# EAGLE design RPI-Lora-Gateway-Shield (EAGLE 7.7.0)
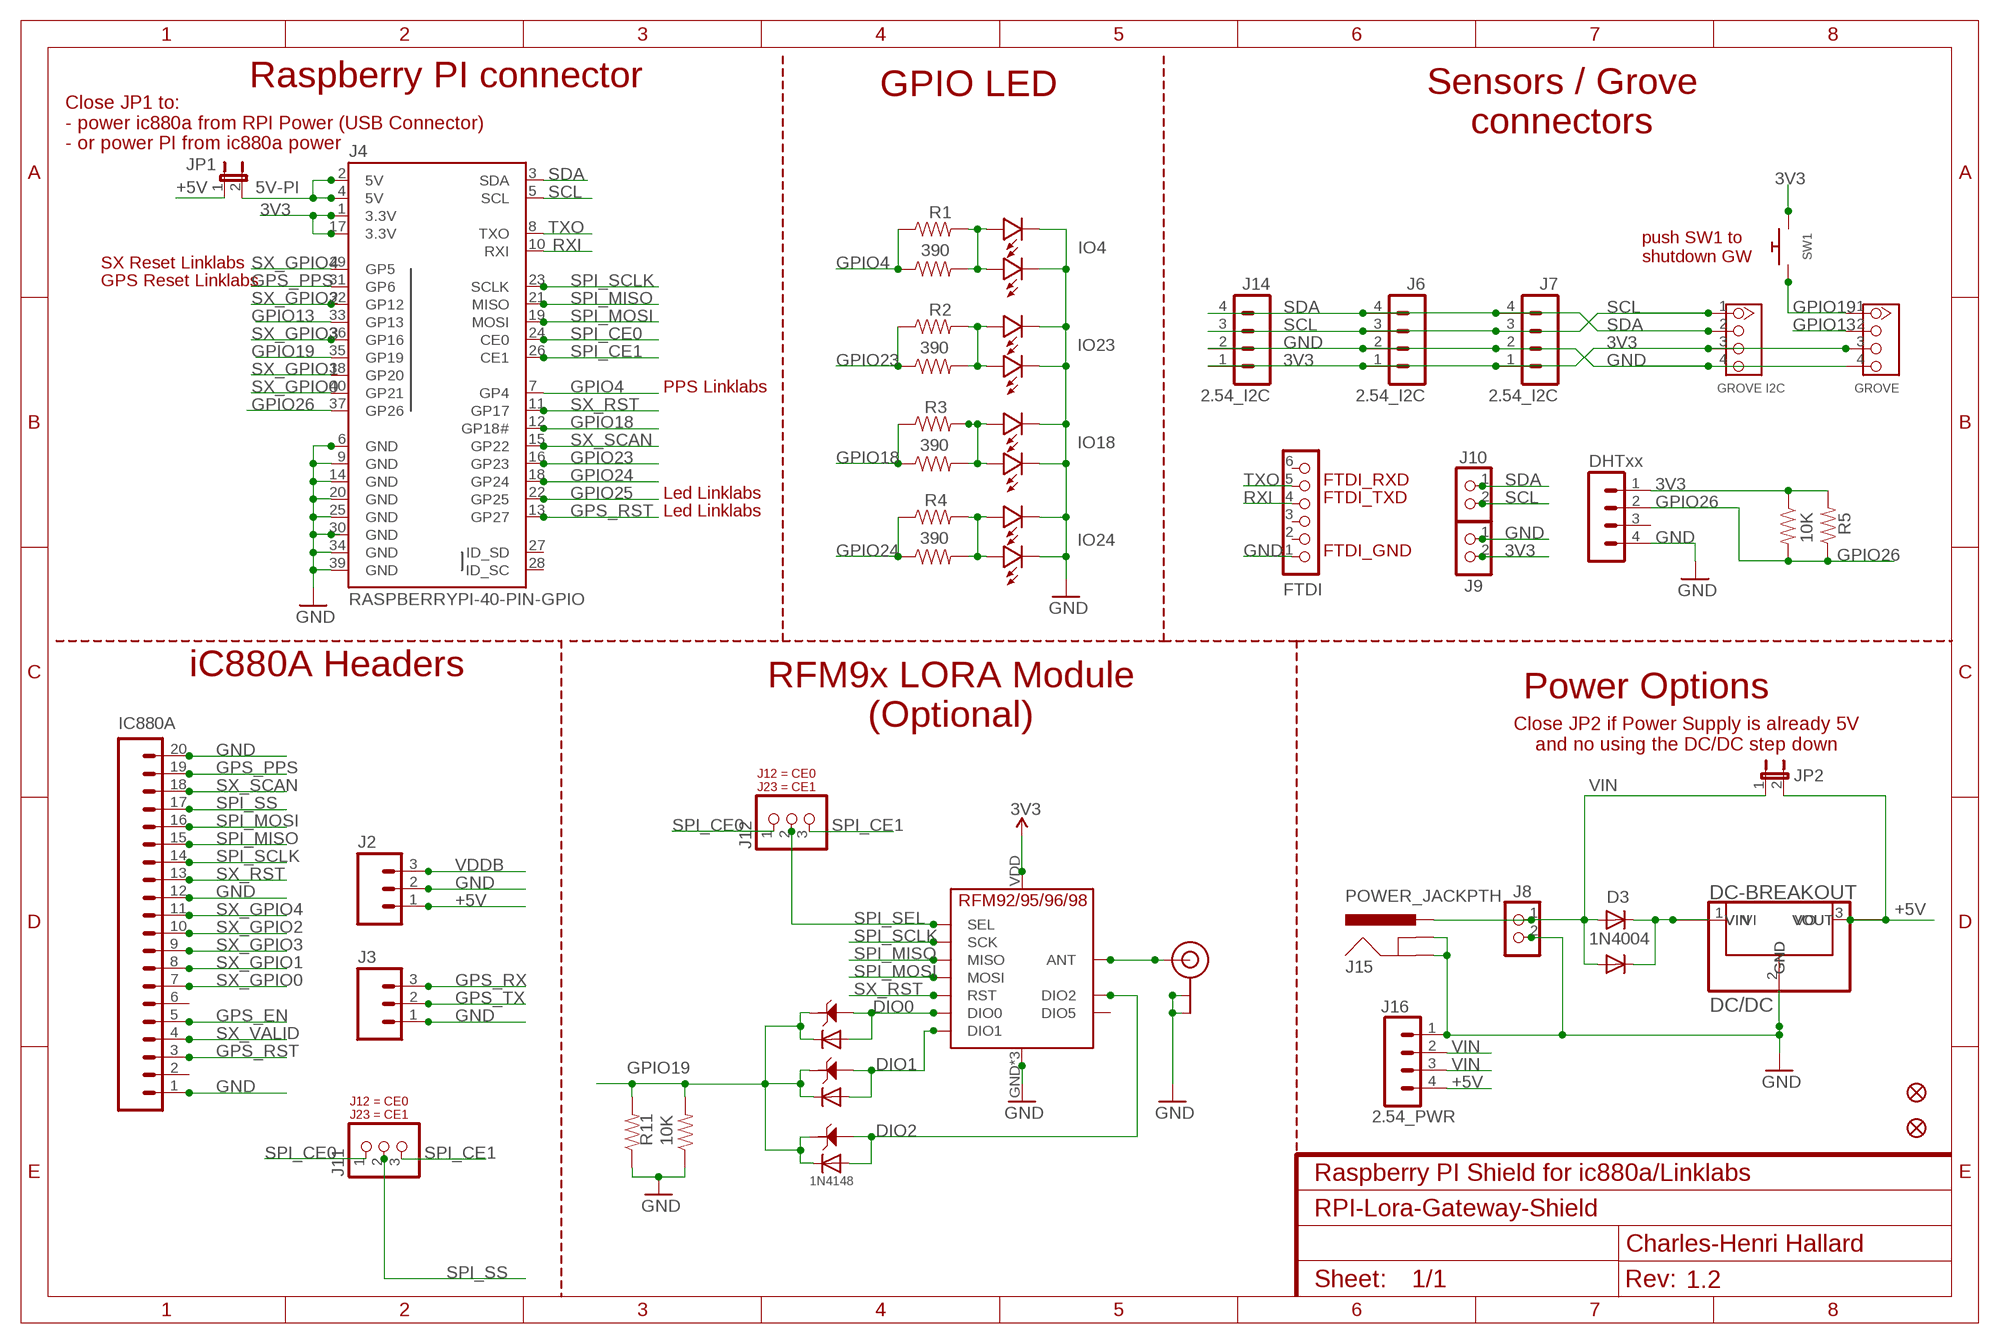
[diagram p0: schematic, sheet 1]
NAME (FRAME-A4L): CNAME: Raspberry PI Shield for ic880a/Linklabs; CREVISION: 1.2; DESIGNER: Charles-Henri Hallard

## Parts
D0  1N4148  D-ESD-2P-CESD5V0D1  [SOD123-2.7X1.6]
D1  1N4148  D-ESD-2P-CESD5V0D1  [SOD123-2.7X1.6]
D2  1N4148  D-ESD-2P-CESD5V0D1  [SOD123-2.7X1.6]
D3  1N4004  [DO41-10]
D4  1N4007  DIODE-DO-214AC  [DO-214AC]
D5  1N4148  DIODEDO-1N4148  [DO-1N4148]
D6  DIODEDO-1N4148  [DO-1N4148]
D7  DIODEDO-1N4148  [DO-1N4148]
DC/DC  DC-BREAKOUT  DC-BREAKOUTSTD  [DC-BREAKOUT]
FID2  FIDUCIAL""  [FIDUCIAL_1MM]
FID3  FIDUCIAL""  [FIDUCIAL_1MM]
FTDI  CON_HEADER_1X06-PTH  [M1X6]
IC880A  M20LOCK  [1X20_LOCK]
J1  GROVE  GROVE-CONNECTOR-DIP(4P-2.0)  [HW4-2.0]
J2  M03LOCK  [1X03_LOCK]
J3  M03LOCK  [1X03_LOCK]
J4  RASPBERRYPI-40-PIN-GPIO  [2X20-SHROUDED]
J5  DHTxx  CON_HEADER_1X04'NO_LOCK'  [1X04_NO_LOCK]
J6  2.54_I2C  CON_HEADER_1X04'NO_LOCK'  [1X04_NO_LOCK]
J7  2.54_I2C  CON_HEADER_1X04'NO_LOCK'  [1X04_NO_LOCK]
J8  CON_TERMINAL_BLOCK_02-5MM  [TERMINAL_BLOCK_2P_5]
J9  CON_TERMINAL_BLOCK_02-5MM  [TERMINAL_BLOCK_2P_5]
J10  CON_TERMINAL_BLOCK_02-5MM  [TERMINAL_BLOCK_2P_5]
J11  JUMPER_1X30805  [JP3_0805]
J12  JUMPER_1X30805  [JP3_0805]
J13  GROVE I2C  GROVE-CONNECTOR-DIP(4P-2.0)  [HW4-2.0]
J14  2.54_I2C  CON_HEADER_1X04'NO_LOCK'  [1X04_NO_LOCK]
J15  POWER_JACKPTH  [POWER_JACK_PTH]
J16  2.54_PWR  CON_HEADER_1X04'NO_LOCK'  [1X04_NO_LOCK]
JP1  JUMPER2  [JUMPER2]
JP2  JUMPER2  [JUMPER2]
LED1  LED0805  [0805-LED]
LED2  LED0805  [0805-LED]
LED3  LED0805  [0805-LED]
LED4  LED0805  [0805-LED]
R1  390  RESISTORPTH-1/4W  [AXIAL-0.4]
R2  390  RESISTORPTH-1/4W  [AXIAL-0.4]
R3  390  RESISTORPTH-1/4W  [AXIAL-0.4]
R4  390  RESISTORPTH-1/4W  [AXIAL-0.4]
R5  10K  RESISTORPTH-1/4W  [AXIAL-0.4]
R6  RESISTOR0805-RES  [0805-RES]
R7  RESISTOR0805-RES  [0805-RES]
R8  RESISTOR0805-RES  [0805-RES]
R9  RESISTOR0805-RES  [0805-RES]
R10  RESISTOR0805-RES  [0805-RES]
R11  10K  RESISTORPTH-1/4W  [AXIAL-0.4]
R12  RESISTOR0805-RES  [0805-RES]
SW1  SWITCH_PUSHBUTTONEVQ-PE  [TACT_PANA-EVQ]
U$2  RFM95  [RFM95]
U$3  ANTENNA-UFL  [UFL_PAD]
U$4  IO4  LED3MM  [LED3MM]
U$5  IO23  LED3MM  [LED3MM]
U$6  IO18  LED3MM  [LED3MM]
U$7  IO24  LED3MM  [LED3MM]
U$8  DC-BREAKOUTFIXED  [DC-DC-FIXED]
U$11  OKI-78SR  DCDC_OKI-78SRHORZ  [OKI-78SRH]

## Nets
3V3: J1.3 J4.1(3.3V) J4.17(3.3V) J5.1 J6.1 J7.1 J9.2 J13.3 J14.1 R5.P$1 R10.2 SW1.P$2 U$2.VDD(VCC)
5V-PI: J4.2(5V) J4.4(5V) JP1.2
+5V: DC/DC.VOUT-1(VOUT) DC/DC.VOUT-2(VOUT) J2.1 J16.4 JP1.1 JP2.2 U$8.VOUT-1(VOUT) U$8.VOUT-2(VOUT) U$11.3(VO)
DIO0: D0.1 D6.A U$2.DIO0
DIO1: D1.1 D7.A U$2.DIO1
DIO2: D2.1 D5.A U$2.DIO2
GND: DC/DC.GND-1(GND) DC/DC.GND-2(GND) DC/DC.GND-3(GND) DC/DC.GND-4(GND) FTDI.1 IC880A.1 IC880A.12 IC880A.20 J1.4 J2.2 J3.1 J4.6(GND) J4.9(GND) J4.14(GND) J4.20(GND) J4.25(GND) J4.30(GND) J4.34(GND) J4.39(GND) J5.4 J6.2 J7.2 J8.2 J9.1 J13.4 J14.2 J15.GND J15.GNDBREAK J16.1 LED1.MINUS LED2.MINUS LED3.MINUS LED4.MINUS R11.P$1 R12.1 U$2.GND U$2.GND1(GND) U$2.GND2(GND) U$3.GND1(GND) U$3.GND2(GND) U$4.MINUS U$5.MINUS U$6.MINUS U$7.MINUS U$8.GND-1(GND) U$8.GND-2(GND) U$8.GND-3(GND) U$8.GND-4(GND) U$11.2(GND)
GPIO4: J4.7(GP4) R1.P$1 R6.1
GPIO13: J1.2 J4.33(GP13)
GPIO18: J4.12(GP18#) R3.P$1 R8.1
GPIO19: D0.2 D1.2 D2.2 D5.C D6.C D7.C J1.1 J4.35(GP19) R11.P$2 R12.2 SW1.P$1
GPIO23: J4.16(GP23) R2.P$1 R7.1
GPIO24: J4.18(GP24) R4.P$1 R9.1
GPIO25: J4.22(GP25)
GPIO26: J4.37(GP26) J5.2 R5.P$2 R10.1
GPS_EN: IC880A.5
GPS_PPS: IC880A.19 J4.31(GP6)
GPS_RST: IC880A.3 J4.13(GP27)
GPS_RX: J3.3
GPS_TX: J3.2
N$14: D3.C D4.1(C) DC/DC.VIN-1(VIN) DC/DC.VIN-2(VIN) U$8.VIN-1(VIN) U$8.VIN-2(VIN) U$11.1(VI)
N$16: LED4.PLUS R4.P$2 R9.2 U$7.PLUS
N$18: LED1.PLUS R1.P$2 R6.2 U$4.PLUS
N$26: LED2.PLUS R2.P$2 R7.2 U$5.PLUS
N$27: LED3.PLUS R3.P$2 R8.2 U$6.PLUS
N$29: U$2.ANT U$3.ANT1(SIGNAL) U$3.ANT2(SIGNAL)
RXI: FTDI.4 J4.10(RXI)
SCL: J4.5(SCL) J6.3 J7.3 J10.2 J13.1 J14.3
SDA: J4.3(SDA) J6.4 J7.4 J10.1 J13.2 J14.4
SPI_CE0: J4.24(CE0) J11.1 J12.1
SPI_CE1: J4.26(CE1) J11.3 J12.3
SPI_MISO: IC880A.15 J4.21(MISO) U$2.MISO
SPI_MOSI: IC880A.16 J4.19(MOSI) U$2.MOSI
SPI_SCLK: IC880A.14 J4.23(SCLK) U$2.SCK
SPI_SEL: J12.2 U$2.NSS(SEL)
SPI_SS: IC880A.17 J11.2
SX_GPIO0: IC880A.7 J4.40(GP21)
SX_GPIO1: IC880A.8 J4.38(GP20)
SX_GPIO2: IC880A.10 J4.32(GP12)
SX_GPIO3: IC880A.9 J4.36(GP16)
SX_GPIO4: IC880A.11 J4.29(GP5)
SX_RST: IC880A.13 J4.11(GP17) U$2.RST
SX_SCAN: IC880A.18 J4.15(GP22)
SX_VALID: IC880A.4
TXO: FTDI.5 J4.8(TXO)
VDDB: J2.3
VIN: D3.A D4.2(A) J8.1 J15.PWR J16.2 J16.3 JP2.1
Unconnected: FTDI.2 FTDI.3 FTDI.6 IC880A.2 IC880A.6 J4.27(ID_SD) J4.28(ID_SC) J5.3 U$2.DIO5

## Notes on the sheet
- Raspberry PI connector | GPIO LED
- Sensors / Grove
  connectors
- Close JP1 to:
  - power ic880a from RPI Power (USB Connector)
  - or power PI from ic880a power
- push SW1 to
  shutdown GW
- SX Reset Linklabs
- GPS Reset Linklabs
- PPS Linklabs
- FTDI_RXD
- Led Linklabs | FTDI_TXD
- Led Linklabs
- FTDI_GND
- iC880A Headers | Power Options
- RFM9x LORA Module
  (Optional)
- Close JP2 if Power Supply is already 5V
  and no using the DC/DC step down

## Library data of the parts
D0 D1 D2 = Seeed-Discrete:D-ESD-2P: Diodes for Protectiong against ESD
D3 = adafruit:1N4004: DIODE General purpose 1N400x type rectifier (With bigger pads) http://www.ladyada.net/library/pcb/eaglelibrary.html
D4 = dp_devices:DIODE: Various Diode Packages
D5-D7 = adafruit:DIODE: Diode SMADIODE - SMA Surface Mount Package 20V 1A Schottky Diode Digikey: 641-1014-6-ND DO-1N4148 - Through Hole Small Current Diode SOD-123 20V 1 A (.5mV Vf) Schottky Diode - Digikey: MBRX120TPMSCT-ND SOD-323 10V 570mA (.38mV Vf, 3ns) Schottky Diode - Digikey: ZLLS410CT-ND SOD-523 30V 30mA Schottky Diode (RB751S-40TE61) - Digikey: RB751S-40TE61CT-ND SOT23-R/W - SOT23 Package (R = Solder Paste/Reflow Ovens, W = Hand-Soldering) BAT54Film 40V 300mA - Digikey: 497-7162-1-ND
DC/DC U$8 = _c2h:DC-BREAKOUT
FID2 FID3 = microbuilder:FIDUCIAL: Fiducial Alignment Points Various fiducial points for machine vision alignment.; BOM: EXCLUDE
FTDI = _c2h:CON_HEADER_1X06
IC880A = SparkFun-Connectors:M20: 1x20 .1" header This is just like the LOCK variant in that the holes are staggared by 5 mil, but except for the last two holes. They are not altered from the "standard" footprint layout. This is used for a special purpose on the layout of our Graphic LCD Backpack. Make sure you want to use this device before selecting it for you project!
J1 J13 = Connector -2016:GROVE-CONNECTOR-DIP(4P-2.0): 320110033; VALUE: 4P-2.0
J2 J3 = SparkFun-Connectors:M03: Header 3 Standard 3-pin 0.1" header. Use with straight break away headers (SKU : PRT-00116), right angle break away headers (PRT-00553), swiss pins (PRT-00743), machine pins (PRT-00117), and female headers (PRT-00115). Molex polarized connector foot print use with SKU : PRT-08232 with associated crimp pins and housings.
J4 = _c2h:RASPBERRYPI-40-PIN-GPIO: Second Generation Raspberry Pi GPIO Header 2x20 pin connector, as found on B, B+, A+ models.
J5-J7 J14 J16 = _c2h:CON_HEADER_1X04
J8-J10 = dp_devices:CON_TERMINAL_BLOCK_02: 2 poles wire to board terminal block
J11 J12 = dp_devices:JUMPER_1X3; J12: CE0; J23: CE1
J15 = SparkFun-Connectors:POWER_JACK: Power Jack This is the standard 5.5mm barrel jack for power. The PTH is the most common, proven, reliable, footprint. The Slot footprint only works if the mill layer is transmitted to the PCB fab house so be warned. Spark Fun Electronics SKU : PRT-00119 SMT: CONN-08106 Mating wall wart : TOL-00298 (and others)
JP1 JP2 = microbuilder:JUMPER2: JUMPER - 2 Pins
LED1-LED4 U$4-U$7 = _c2h:LED
R1-R12 = _c2h:RESISTOR: Resistor Basic schematic elements and footprints for 0603, 1206, and PTH resistors.
SW1 = adafruit:SWITCH_PUSHBUTTON: Buttons SOFTTOUCHSMD_SJ - Soft touch temporary push button (Super Junk Akihabara) Compatible with SKPMANE010 [Mouser: 688-SKPMAN] C&K_KSS = Digikey: KSS221GLFS
U$2 = _c2h:RFM95
U$3 = _c2h:ANTENNA-UFL
U$11 = _c2h:DCDC_OKI-78SR: 4.95W DC/DC Converter Manufacturer: Murata Part Number: OKI-78SR-5/1.5-W36H-C OKI-78SR-3.3/1.5-W36H-C

## Board
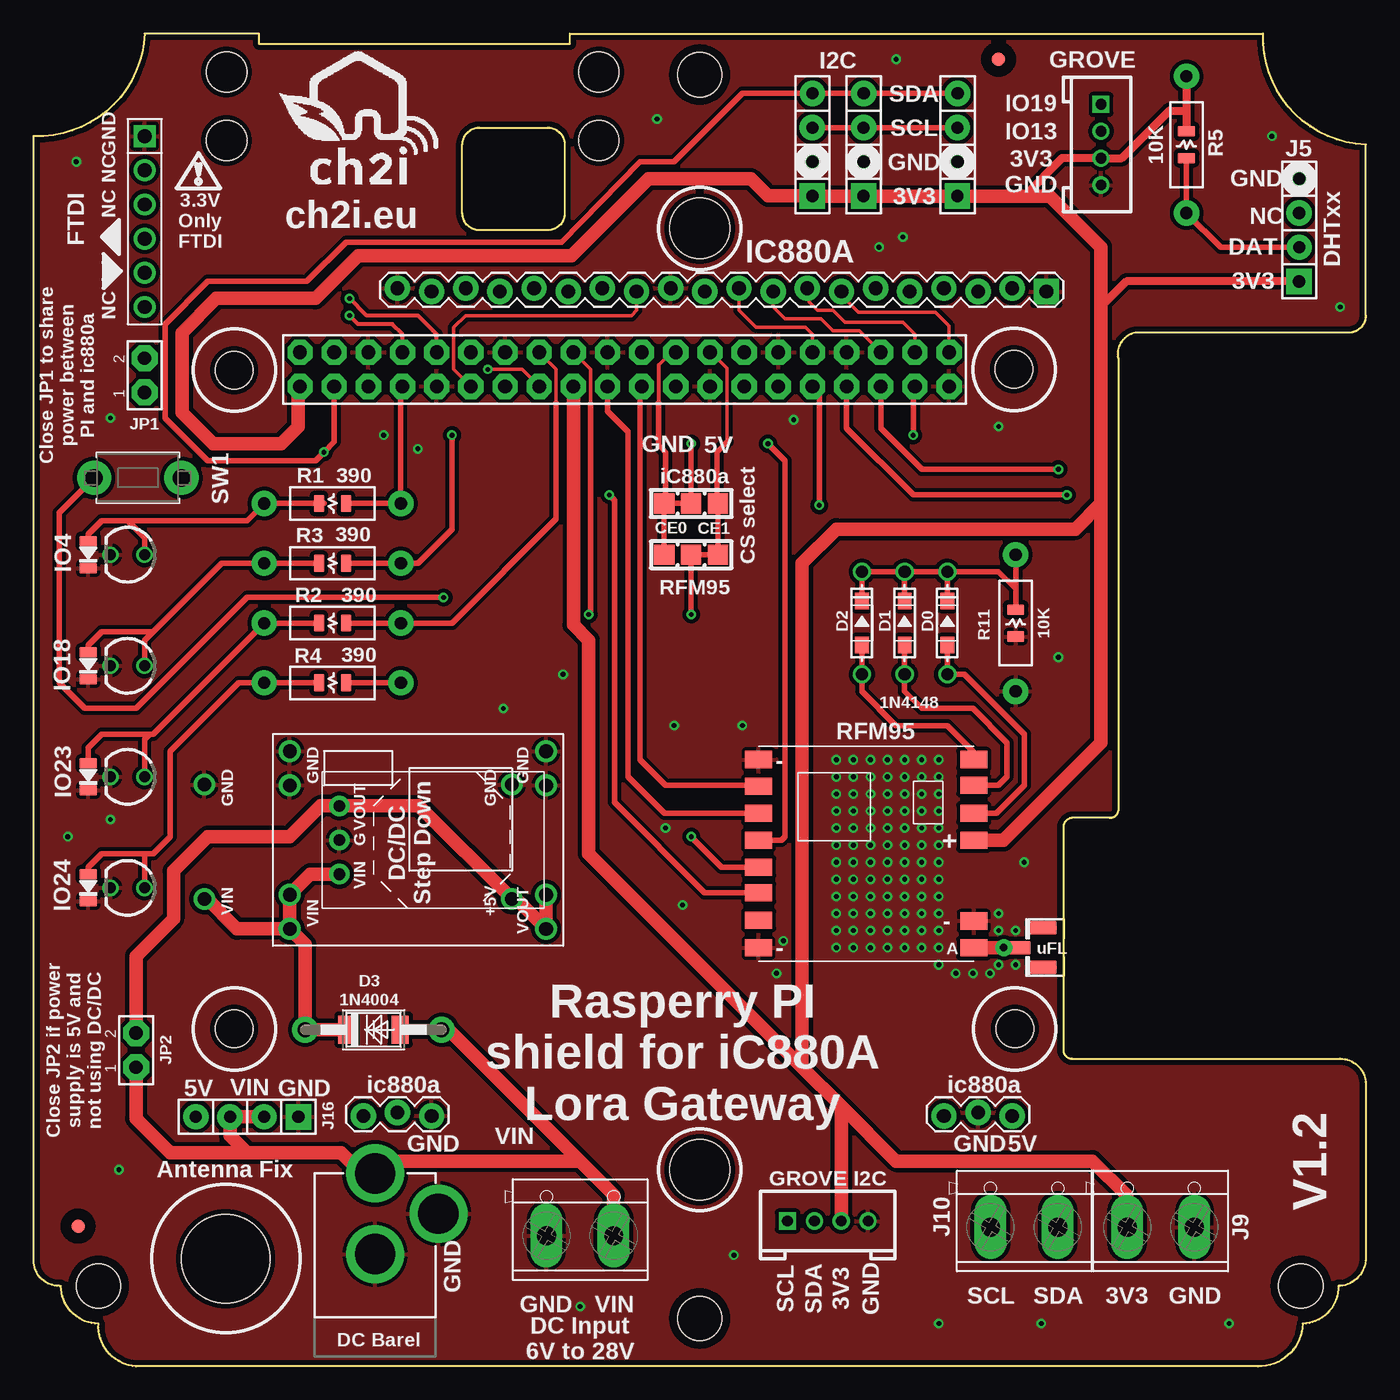
[diagram p1: board, top side]
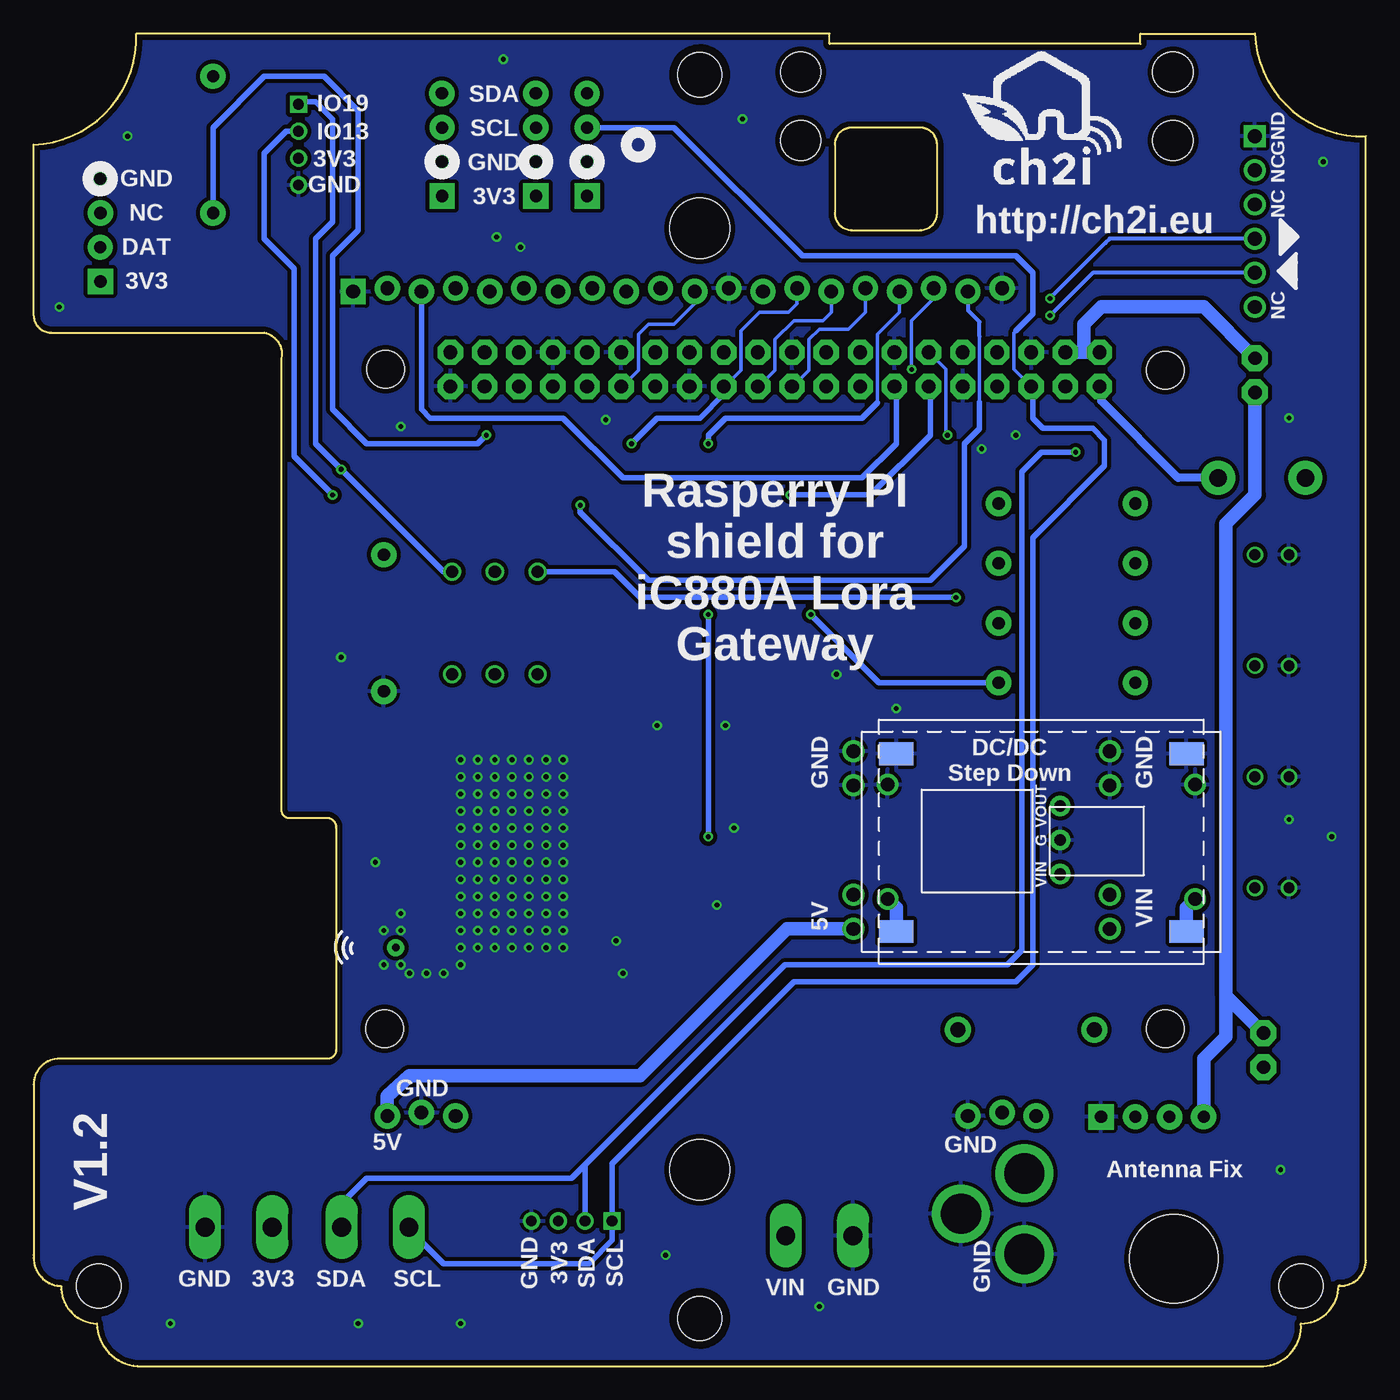
[diagram p2: board, bottom side, seen from below]

Size 99.07 x 99.06 mm. Coordinates in mm from the lower left corner, seen from the top.
Outline: 0,7.87 0,91.44 arc90 8.26,99.06 16.76,99.06 16.76,98.3 39.88,98.3 39.88,99.06 91.44,99.06 arc90 99.06,90.81 99.06,78.11 arc-90 97.79,76.83 81.92,76.83 arc90 80.64,74.93 80.64,41.27 arc-90 80.01,40.77 77.22,40.77 arc90 76.58,40.01 76.58,23.5 arc90 77.22,22.86 97.16,22.86 arc-90 99.06,20.95 99.06,8.26 arc-90 97.16,5.97 97.03,5.97 arc-90 94.36,3.17 arc-90 91.06,0 7.62,0 arc-90 4.83,3.17 arc-90 2.03,5.97 1.91,5.97 arc-90 0,7.87
Outline: 31.88,85.72 31.88,90.81 arc-90 33.15,92.08 38.23,92.08 arc-90 39.5,90.81 39.5,85.72 arc-90 38.23,84.45 33.15,84.45 arc-90 31.88,85.72
Copper layers (1*16): Top 0.0356mm / dielectric 1.5011mm / Bottom 0.0356mm
Design rules "PCBs_io": minimum track width 6mil, minimum drill 13mil, track to track 6mil, track to pad 6mil, pad to pad 6mil, via to via 6mil, smd to smd 6mil, copper to edge 15mil, drill to drill 6mil, minimum pad ring 7mil, minimum via ring 7mil, stop-mask expansion 3mil, vias tented up to drill 40mil, thermal gap 10mil
Holes 2.79 mm at 14.92,74.04 72.9,74.1 72.96,25.08 14.92,25.08
Holes 6.6 mm at 14.29,8
Holes 4.5 mm at 49.53,14.61 49.53,84.58
Holes 3 mm at 42.04,96.2 14.35,96.2 42.04,91.12 14.35,91.12

### Footprints (pad centres in the part's own frame; a part is rotated, then mirrored left to right if it is on the bottom)
SOD123-2.7X1.6 = smd 1.2 x 1.02: 1 -1.635,0; 2 1.635,0
DO41-10 = drill 1.118 pad 1.93: A 5.08,0; C -5.08,0
DO-214AC = smd 1.27 x 2.1: 1 -1.98,0; 2 1.98,0
DO-1N4148 = drill 0.9: A -3.81,0; C 3.81,0
DC-BREAKOUT = drill 1.02 pad 1.632: GND-1 -10.16,6.35; GND-2 -10.16,3.81; GND-3 8.89,6.35; GND-4 8.89,3.81; VIN-1 -10.16,-4.318; VIN-2 -10.16,-6.858; VOUT-1 8.89,-4.318; VOUT-2 8.89,-6.858
FIDUCIAL_1MM = smd 1 x 1: 1 0,0
M1X6 = drill 1.02 pad 1.632 square: 1 0,0 | drill 1.02 pad 1.632: 2 2.54,0; 3 5.08,0; 4 7.62,0; 5 10.16,0; 6 12.7,0
STAND-OFF = hole 3.302: 0,0
1X20_LOCK = drill 1.016 pad 1.88 square: 1 0,0.127 | drill 1.016 pad 1.88: 2 2.54,-0.127; 3 5.08,0.127; 4 7.62,-0.127; 5 10.16,0.127; 6 12.7,-0.127; 7 15.24,0.127; 8 17.78,-0.127; 9 20.32,0.127; 10 22.86,-0.127; 11 25.4,0.127; 12 27.94,-0.127; 13 30.48,0.127; 14 33.02,-0.127; 15 35.56,0.127; 16 38.1,-0.127; 17 40.64,0.127; 18 43.18,-0.127; 19 45.72,0.127; 20 48.26,-0.127
HW4-2.0 = drill 0.8 pad 1.27 square: 1 -3,0 | drill 0.8 pad 1.27: 2 -1,0; 3 1,0; 4 3,0
1X03_LOCK = drill 1.016 pad 1.88: 1 0,0.127; 2 2.54,-0.127; 3 5.08,0.127
2X20-SHROUDED = drill 1.016 pad 1.88 octagon: 1 -1.27,24.13; 2 1.27,24.13; 3 -1.27,21.59; 4 1.27,21.59; 5 -1.27,19.05; 6 1.27,19.05; 7 -1.27,16.51; 8 1.27,16.51; 9 -1.27,13.97; 10 1.27,13.97; 11 -1.27,11.43; 12 1.27,11.43; 13 -1.27,8.89; 14 1.27,8.89; 15 -1.27,6.35; 16 1.27,6.35; 17 -1.27,3.81; 18 1.27,3.81; 19 -1.27,1.27; 20 1.27,1.27; 21 -1.27,-1.27; 22 1.27,-1.27; 23 -1.27,-3.81; 24 1.27,-3.81; 25 -1.27,-6.35; 26 1.27,-6.35; 27 -1.27,-8.89; 28 1.27,-8.89; 29 -1.27,-11.43; 30 1.27,-11.43; 31 -1.27,-13.97; 32 1.27,-13.97; 33 -1.27,-16.51; 34 1.27,-16.51; 35 -1.27,-19.05; 36 1.27,-19.05; 37 -1.27,-21.59; 38 1.27,-21.59; 39 -1.27,-24.13; 40 1.27,-24.13
1X04_NO_LOCK = drill 0.9 pad 1.88 square: 1 -3.816,-0.121 | drill 0.9 pad 1.88: 2 -1.27,-0.133; 3 1.27,-0.121; 4 3.81,-0.133
TERMINAL_BLOCK_2P_5 = drill 1.4 pad 2.38 long: 1 2.5,-0.45; 2 -2.5,-0.45
JP3_0805 = smd 1.5 x 1.5: 1 -2,0; 2 0,0; 3 2,0
POWER_JACK_PTH = drill 2.997 pad 4.318: GND 0,7.7; GNDBREAK 4.7,10.7; PWR 0,13.7
JUMPER2 = drill 1 pad 1.93 octagon: 1 2.54,0; 2 0,0
0805-LED = smd 0.8 x 1.3: MINUS -1,0; PLUS 1,0
AXIAL-0.4 = drill 0.9 pad 1.88: P$1 -5.08,0; P$2 5.08,0
0805-RES = smd 0.8 x 1.3: 1 -1,0; 2 1,0
TACT_PANA-EVQ = drill 1.3 pad 2.54: P$1 -3.25,0; P$2 3.25,0
RFM95 = smd 2 x 1.27: ANT 5.777,-7; DIO0 5.777,3; DIO1 5.779,5.095; DIO2 5.779,7; DIO5 -10.225,-4.936; GND 5.777,-5; GND1 -10.223,7; GND2 -10.23,-7; MISO -10.23,5; MOSI -10.225,3; NSS -10.223,-1; RST -10.223,-2.905; SCK -10.23,1.012; VDD 5.777,1
UFL_PAD = smd 1.524 x 1.016: ANT1 -3.843,0 | drill 0.559 pad 1.27: ANT2 -5.08,0 | smd 2.2 x 1.016: GND1 -2.223,1.47; GND2 -2.223,-1.47
LED3MM = drill 0.813: MINUS 1.27,0; PLUS -1.27,0
DC-DC-FIXED = smd 2.54 x 1.676: GND-1 -8.89,-6.477; GND-3 12.7,-6.477; VIN-1 -8.89,6.731; VOUT-2 12.7,6.731 | drill 1.02 pad 1.632: GND-2 -9.525,-4.191; GND-4 13.335,-4.191; VIN-2 -9.525,4.318; VOUT-1 13.335,4.318
OKI-78SRH = drill 0.864 pad 1.524: 1 2.54,0; 2 0,0; 3 -2.54,0

### Placement (x,y rotation side)
D0  67.94,55.24 90 top
D1  64.77,55.24 90 top
D2  61.59,55.24 90 top
D3  25.27,25.02 0 top
D4  25.27,25.02 0 top
D5  61.59,55.24 90 top
D6  67.94,55.24 90 top
D7  64.77,55.24 90 top
DC/DC  29.21,39.37 0 top
FID2  3.3,10.41 0 top
FID3  71.75,97.16 0 top
FTDI  8.26,91.44 270 top
H1  STAND-OFF  [STAND-OFF]  4.83,5.97 0 top
H2  STAND-OFF  [STAND-OFF]  49.53,96.01 0 top
H3  STAND-OFF  [STAND-OFF]  94.23,5.97 0 top
H4  STAND-OFF  [STAND-OFF]  49.53,3.56 0 top
IC880A  75.31,80.01 180 top
J1  79.38,90.81 270 top
J2  72.77,18.73 180 top
J3  29.59,18.73 180 top
J4  43.94,74.1 90 top
J5  93.98,84.45 90 top
J6  57.78,90.81 90 top
J7  61.59,90.81 90 top
J8  40.64,10.16 0 top
J9  83.82,10.79 0 top
J10  73.66,10.79 0 top
J11  48.9,64.14 0 top
J12  48.9,60.33 0 top
J13  59.05,10.79 0 top
J14  68.58,90.81 90 top
J15  25.4,0.64 0 top
J16  15.88,18.41 180 top
JP1  8.26,74.93 270 top
JP2  7.62,24.77 270 top
LED1  4.06,60.33 90 top
LED2  4.06,43.81 90 top
LED3  4.06,52.07 90 top
LED4  4.06,35.56 90 top
R1  22.23,64.14 180 top
R2  22.23,55.24 180 top
R3  22.23,59.69 180 top
R4  22.23,50.8 180 top
R5  85.72,90.81 270 top
R6  22.23,64.14 180 top
R7  22.23,55.24 180 top
R8  22.23,59.69 180 top
R9  22.23,50.8 180 top
R10  85.72,90.81 90 top
R11  73.03,55.24 90 top
R12  73.03,55.24 90 top
SW1  7.75,66.04 0 top
U$1  [LOGO_CH2I_110MM]  24.77,90.81 0 top
U$2  64.14,38.1 0 top
U$3  77.22,31.11 0 top
U$4  6.99,60.33 180 top
U$5  6.99,43.81 180 top
U$6  6.99,52.07 180 top
U$7  6.99,35.56 180 top
U$8  22.23,39.05 180 bottom
U$9  [LOGO_CH2I_110MM]  23.5,90.81 0 bottom
U$11  22.73,39.12 270 top

### Tracks (layer width: path | path; a pad name or v marks a point on that pad's centre or on a via)
3V3
  Top 0.61: R5.P$1 85.72,93.34 | 85.72,93.34 R10.2 | 73.66,86.99 76.48,89.81 J1.3 80.92,89.81 84.45,93.34 85.72,93.34 | J5.1 81.27,80.64 79.38,78.74
  Top 0.813: 19.68,72.71 J4.1 | 81.28,10.3 J9.2
  Top 1.016: 19.68,72.71 19.68,69.85 18.41,68.58 13.34,68.58 11.05,70.87 11.05,76.83 13.59,79.38 20.95,79.38 24.13,82.55 40.01,82.55 45.72,88.27 53.34,88.27 54.61,87 J6.1 J7.1 J14.1 | J9.2 81.28,10.38 81.28,12.7 78.74,15.24 64.14,15.24 60.05,19.32 | 79.38,64.14 79.38,78.74 79.38,83.19 75.57,86.99 73.66,86.99 J14.1 | 79.38,64.14 79.38,46.35 72.12,39.1 U$2.VDD | J4.17 40.13,55.12 41.27,53.98 41.27,38.1 57.15,22.23 | 57.15,22.23 60.05,19.32 | J13.3 60.05,19.32 | 57.15,22.23 57.15,59.69 59.69,62.23 77.47,62.23 79.38,64.14 | 68.58,86.87 J14.1
  Bottom 0.61: SW1.P$2 13.97,66.04 19.68,71.75 19.68,72.71 J4.1
5V-PI
  Bottom 1.016: J4.2 20.95,75.37 | 20.95,75.37 J4.4 | 20.95,75.37 20.95,77.47 19.68,78.74 12.06,78.74 JP1.2
+5V
  Top 1.016: DC/DC.VOUT-1 DC/DC.VOUT-2 35.88,34.73 U$8.VOUT-1 28.64,41.66 U$11.3 21.34,41.66 19.05,39.37 12.95,39.37 10.41,36.83 10.41,33.27 7.62,30.48 JP2.2
  Bottom 1.016: J2.1 72.77,20.07 71.12,21.59 53.98,21.59 43.05,32.51 DC/DC.VOUT-2 | U$8.VOUT-2 34.92,34.1 U$8.VOUT-1 | 10.41,27.56 JP2.2 | J16.4 12.06,22.86 10.41,24.51 10.41,27.56 | 10.41,27.56 10.41,62.61 8.26,64.77 JP1.1
DIO0
  Top 0.406: D0.1 D6.A 69.22,51.44 73.66,46.99 73.66,43.18 71.58,41.1 U$2.DIO0
DIO1
  Top 0.406: D1.1 D7.A 64.77,50.16 66.04,48.9 69.85,48.9 72.39,46.35 72.39,43.81 71.75,43.18 69.93,43.18 U$2.DIO1
DIO2
  Top 0.406: 61.29,53.91 D2.1 D5.A 61.59,50.16 64.14,47.62 67.94,47.62 69.85,45.72 69.85,45.16 U$2.DIO2
GND  (via drill 0.36 pad 0.71)
  other vias: 47.62,47.62 97.16,78.74 62.87,83.19 64.14,97.16 46.35,92.71 3.17,89.53 5.71,70.48 2.54,39.37 6.35,14.61 40.64,4.45 52.07,8.26 74.93,3.17 88.9,3.17 67.31,3.17 73.66,37.47 92.08,91.44 64.64,83.95 5.71,40.64 26.04,69.22 28.57,68.2 56.52,70.36 34.92,48.9 71.75,29.84 73.03,29.84 71.75,32.38 73.03,32.38 71.75,33.66 71.12,29.21 69.85,29.21 68.58,29.21 67.31,34.92 67.31,33.66 67.31,32.38 67.31,31.11 67.31,29.84 67.31,36.2 67.31,37.47 67.31,38.73 67.31,40.01 67.31,41.27 67.31,42.55 67.31,43.81 67.31,45.09 66.04,45.09 66.04,43.81 66.04,42.55 66.04,41.27 66.04,40.01 66.04,38.73 66.04,37.47 66.04,36.2 66.04,34.92 66.04,33.66 66.04,32.38 66.04,31.11 64.77,45.09 64.77,43.81 64.77,42.55 64.77,41.27 64.77,40.01 64.77,38.73 64.77,37.47 64.77,36.2 64.77,34.92 64.77,33.66 64.77,32.38 64.77,31.11 63.5,34.92 63.5,33.66 63.5,32.38 63.5,31.11 63.5,36.2 63.5,37.47 63.5,38.73 63.5,40.01 63.5,41.27 63.5,42.55 63.5,43.81 63.5,45.09 62.23,45.09 62.23,43.81 62.23,42.55 62.23,41.27 62.23,40.01 62.23,38.73 62.23,37.47 62.23,36.2 62.23,34.92 62.23,33.66 62.23,32.38 62.23,31.11 60.96,34.92 60.96,33.66 60.96,32.38 60.96,31.11 60.96,36.2 60.96,37.47 60.96,38.73 60.96,40.01 60.96,41.27 60.96,42.55 60.96,43.81 60.96,45.09 59.69,45.09 59.69,43.81 59.69,42.55 59.69,41.27 59.69,40.01 59.69,38.73 59.69,37.47 59.69,36.2 59.69,34.92 59.69,33.66 59.69,32.38 59.69,31.11 52.7,47.62 39.37,51.44 55.24,29.21 48.26,34.29 46.99,40.01 55.75,31.62 76.2,52.7 71.75,69.85
  pour Top (isolate 0.305): -1.91,99.69 100.97,99.69 100.97,-1.27 -1.91,-1.27
  pour Bottom (isolate 0.305): -3.17,100.97 102.23,100.97 102.23,-2.54 -3.17,-2.54
GPIO4
  Top 0.406: J4.7 27.3,72.71 R1.P$1 R6.1
GPIO13  (via drill 0.36 pad 0.71)
  Top 0.406: J4.33 60.45,69.72 65.41,64.77 v76.83,64.77
  Bottom 0.406: v76.83,64.77 79.69,67.63 79.69,81.6 81.92,83.82 81.92,90.17 80.28,91.81 J1.2
GPIO18  (via drill 0.36 pad 0.71)
  Top 0.406: R8.1 R3.P$1 28.57,59.69 31.11,62.23 v31.11,69.22
  Bottom 0.254: J4.12 31.24,74.11 31.24,69.34 v31.11,69.22
GPIO19  (via drill 0.36 pad 0.71)
  Top 0.406: J4.35 62.99,69.72 66.04,66.67 v76.2,66.67 | 73.03,57.78 R12.2 72.93,56.34 | 73.03,57.78 R11.P$2 | D2.2 D5.C D7.C | D1.2 D7.C | D0.2 D6.C | D6.C D7.C | D6.C 71.75,59.05 73.03,57.78 | v30.48,57.15 15.88,57.15 7.62,48.9 3.81,48.9 1.91,50.8 1.91,63.45 SW1.P$1
  Bottom 0.406: J1.1 79.2,93.98 78.11,93.98 76.83,92.71 76.83,85.09 78.11,83.82 78.11,68.58 v76.2,66.67 68.58,59.05 D6.C | D5.C 55.88,59.05 53.98,57.15 v30.48,57.15
GPIO23
  Top 0.254: 38.86,71.63 38.86,74.11 J4.16
  Top 0.406: R7.1 R2.P$1 31.11,55.24 38.86,62.99 38.86,71.63
GPIO24  (via drill 0.36 pad 0.71)
  Top 0.254: 41.4,71.56 41.4,74.11 J4.18
  Top 0.305: 41.4,56.01 v41.27,55.88
  Top 0.406: R9.1 R4.P$1 | 41.4,71.56 41.4,56.01
  Bottom 0.406: R4.P$1 36.2,50.8 v41.27,55.88
GPIO26  (via drill 0.36 pad 0.71)
  Top 0.406: v65.41,69.22 65.41,72.71 J4.37 | R10.1 R5.P$2 88.27,83.19 J5.2
  Bottom 0.406: v65.41,69.22 66.04,68.58 74.3,68.58 76.83,71.12 76.83,82.55 74.93,84.45 74.93,93.34 77.47,95.89 81.92,95.89 85.72,92.08 R5.P$2
GPS_PPS  (via drill 0.36 pad 0.71)
  Top 0.406: v58.42,64.01 58.42,72.33 J4.31
  Bottom 0.254: 28.73,76.55 28.73,71.66
  Bottom 0.305: 28.73,76.55 28.73,77.63 29.59,78.49 IC880A.19
  Bottom 0.406: 28.73,71.66 28.73,69.69 29.84,68.58 29.84,60.96 32.38,58.42 53.34,58.42 58.42,63.5 v58.42,64.01
GPS_RST
  Bottom 0.254: 34.92,72.71 J4.13
  Bottom 0.406: IC880A.3 70.23,71.12 69.6,70.48 59.69,70.48 55.24,66.04 37.47,66.04 34.92,68.58 34.92,72.71
N$14
  Top 1.016: D4.1 D3.C 20.19,31.37 DC/DC.VIN-2 | DC/DC.VIN-2 DC/DC.VIN-1 20.57,36.58 U$11.1 | U$8.VIN-2 12.89,34.73 15.11,32.51 DC/DC.VIN-2
  Bottom 1.016: U$8.VIN-1 13.34,34.1 U$8.VIN-2
N$16
  Top 0.406: R9.2 R4.P$2 15.24,50.8 10.16,45.72 10.16,39.37 8.89,38.1 8.26,38.1 | 8.26,38.1 5.08,38.1 4.06,37.08 LED4.PLUS | U$7.PLUS 8.26,38.1
N$18
  Top 0.406: 21.59,64.14 R6.2 R1.P$2 15.88,62.87 6.99,62.87 | LED1.PLUS 4.06,61.85 5.08,62.87 6.99,62.87 | U$4.PLUS 8.26,61.59 6.99,62.87
N$26
  Top 0.406: LED2.PLUS 4.06,45.97 5.08,46.99 8.64,46.99 | R7.2 R2.P$2 8.89,46.99 8.64,46.99 | 8.64,43.81 U$5.PLUS 8.26,46.61 8.64,46.99
N$27
  Top 0.406: LED3.PLUS 4.06,53.59 5.08,54.61 8.89,54.61 | U$6.PLUS 8.26,53.98 8.89,54.61 | R8.2 R3.P$2 13.97,59.69 8.89,54.61
N$29
  Top 1.016: U$2.ANT 69.93,31.11 U$3.ANT2 U$3.ANT1
RXI  (via drill 0.36 pad 0.71)
  Top 0.305: J4.10 29.97,76.71 28.57,78.11 24.77,78.11 v23.5,79.38
  Bottom 0.305: v23.5,79.38 19.37,83.5 19.05,83.82 FTDI.4
SCL
  Top 0.406: J6.3 J7.3 J14.3
  Bottom 0.254: 26.04,76.96 26.16,76.83 26.16,74.11 J4.5
  Bottom 0.406: J4.5 24.77,72.71 24.77,70.48 24,69.72 20.32,69.72 19.43,68.83 19.43,66.93 24.77,61.59 24.77,29.84 26.04,28.57 42.55,28.57 56.05,15.06 J13.1 56.05,9.35 57.78,7.62 68.58,7.62 71.16,10.2 J10.2 | 26.04,76.96 24.77,78.23 24.77,81.28 26.04,82.55 41.91,82.55 51.44,92.08 J6.3
SDA  (via drill 0.36 pad 0.71)
  Top 0.406: J14.4 J7.4 J6.4 52.7,94.61 47.62,89.53 45.09,89.53 39.24,83.57 23.24,83.57 20.32,80.64 12.95,80.64 9.78,77.47 9.78,70.48 12.95,67.31 20.95,67.31 v21.59,67.94 22.35,68.71 J4.3
  Bottom 0.406: J10.1 76.16,12.11 74.3,13.97 59.05,13.97 58.05,14.97 | J13.2 58.05,14.97 | v21.59,67.94 24.13,67.94 25.59,66.48 25.59,30.92 26.67,29.84 43.18,29.84 58.05,14.97
SPI_CE0
  Top 0.254: J4.24 47.43,75.37 46.48,74.42
  Top 0.305: 46.48,74.42 46.48,71.63
  Top 0.406: J11.1 46.99,64.23 46.99,67.94 46.67,68.26 46.48,68.45 46.48,71.63 | J11.1 J12.1 46.99,60.23 | J11.1 48.9,64.14
SPI_CE1
  Top 0.254: J4.26 50.35,75.37 51.56,74.17 51.56,68.71
  Top 0.406: J12.3 J11.3 50.8,64.23 50.8,67.94 51.56,68.71 | 50.8,60.23 J12.3 | J12.3 48.9,60.33
SPI_MISO
  Top 0.305: J4.21 45.21,72.52 45.09,72.39 | 53.83,43.18 U$2.MISO
  Top 0.406: 45.09,72.39 45.09,45.09 46.99,43.18 53.83,43.18
  Bottom 0.254: J4.21 45.15,72.83 43.94,74.04 43.94,76.33 42.55,77.72 40.39,77.72 39.75,78.36 IC880A.15
SPI_MOSI
  Top 0.406: J4.19 42.67,70.99 44.2,69.47 44.2,43.81 46.91,41.1 U$2.MOSI
  Bottom 0.254: J4.19 42.61,72.83 41.4,74.04 41.4,76.33 40.64,77.09 38.48,77.09 37.21,78.36 IC880A.16
SPI_SCLK  (via drill 0.36 pad 0.71)
  Top 0.406: U$2.SCK 55.62,39.11 55.88,39.37 55.88,67.31 v54.61,68.58
  Bottom 0.254: J4.23 47.69,72.83 46.48,74.04 46.48,76.96 45.09,78.36 42.93,78.36 42.29,78.99 IC880A.14
  Bottom 0.406: J4.23 47.75,72.26 49.53,70.48 52.7,70.48 v54.61,68.58
SPI_SEL  (via drill 0.36 pad 0.71)
  Top 0.406: J12.2 48.9,57.15 48.9,56.52 v48.9,55.88 | U$2.NSS 51.16,37.1 v48.9,39.37
  Bottom 0.406: v48.9,39.37 v48.9,55.88
SPI_SS  (via drill 0.36 pad 0.71)
  Top 0.406: v48.9,68.58 J11.2
  Bottom 0.254: 36.32,71.63 36.32,76.71 34.67,78.36 IC880A.17
  Bottom 0.406: 36.32,71.63 37.47,70.48 47.62,70.48 48.9,69.22 v48.9,68.58
SX_GPIO0
  Top 0.254: IC880A.7 60.07,79.63 61.34,78.36 67.06,78.36 68.07,77.34 J4.40
SX_GPIO1
  Top 0.254: IC880A.8 57.66,80.14 57.66,79.12 58.29,78.49 59.44,78.49 60.33,77.6 64.64,77.6 65.53,76.71 J4.38
SX_GPIO2
  Top 0.254: IC880A.10 52.45,78.49 53.72,77.22 57.4,77.22 57.91,76.71 J4.32
SX_GPIO3
  Top 0.254: IC880A.9 54.99,78.74 55.88,77.85 58.55,77.85 59.44,76.96 61.4,76.96 J4.36
SX_GPIO4
  Bottom 0.254: IC880A.11 49.91,78.99 51.44,77.47 53.34,77.47 54.1,76.71 54.1,74.04 55.31,72.83 J4.29
SX_RST  (via drill 0.36 pad 0.71)
  Top 0.254: IC880A.13 44.83,78.49 44.45,78.11 32.13,78.11 31.24,77.22 31.24,74.11 J4.11
  Top 0.406: v42.8,64.77 43.18,64.39 43.18,41.91 49.9,35.2 U$2.RST
  Bottom 0.305: 32.38,72.71 J4.11
  Bottom 0.406: v42.8,64.77 36.83,64.77 32.38,69.22 32.38,72.71
SX_SCAN  (via drill 0.33 pad 0.61)
  Top 0.254: IC880A.18 32.13,79.38 | J4.15 36.32,74.11 v33.78,74.11
  Bottom 0.254: v33.78,74.11 33.78,77.72 32.13,79.38 IC880A.18
TXO  (via drill 0.36 pad 0.71)
  Top 0.305: J4.8 27.43,76.71 26.67,77.47 24.13,77.47 v23.5,78.11
  Bottom 0.305: v23.5,78.11 20.32,81.28 FTDI.5
VIN
  Top 0.813: D3.A D4.2
  Top 1.016: J8.1 43.14,12.74 40.64,15.24 | 40.64,15.24 26.3,15.24 J15.PWR 24.4,14.34 22.86,15.88 15.88,15.88 | D3.A 30.86,25.02 40.64,15.24 | JP2.1 7.62,18.41 10.16,15.88 15.88,15.88 | J16.2 17.13,18.54 J16.3 14.61,17.14 15.88,15.88

### Text on the board
tPlace: I2C | SDA | IO19 | SCL | IO13 | GND | 3V3 | GND | GND | 3V3 | ch2i.eu | NC | DAT | 3V3 | Close JP1 to share / power between / PI and ic880a | GND | 5V | iC880a | CS select | RFM95 | VOUT | G | DC/DC / Step Down | VIN | Close JP2 if power / supply is 5V and / not using DC/DC | Rasperry PI / shield for iC880A / Lora Gateway | 5V | VIN | GND | ic880a | ic880a | GND | VIN | GND | 5V | Antenna Fix | V1.2 | GND | SCL | SDA | 3V3 | GND | GND | VIN | SCL | SDA | 3V3 | GND | DC Barel | DC Input / 6V to 28V
bPlace: SDA | IO19 | SCL | IO13 | GND | 3V3 | GND | GND | 3V3 | NC | http://ch2i.eu | DAT | 3V3 | Rasperry PI / shield for / iC880A Lora / Gateway | GND | DC/DC / Step Down | GND | VIN | 5V | GND | GND | 5V | Antenna Fix | V1.2 | SCL | SDA | 3V3 | GND | GND | SCL | SDA | 3V3 | GND | GND | VIN
tNames: GND | NC | NC | 3.3V / Only / FTDI | NC
bNames: GND | NC | NC | NC